# EAGLE design mcu (EAGLE 8.6.3)
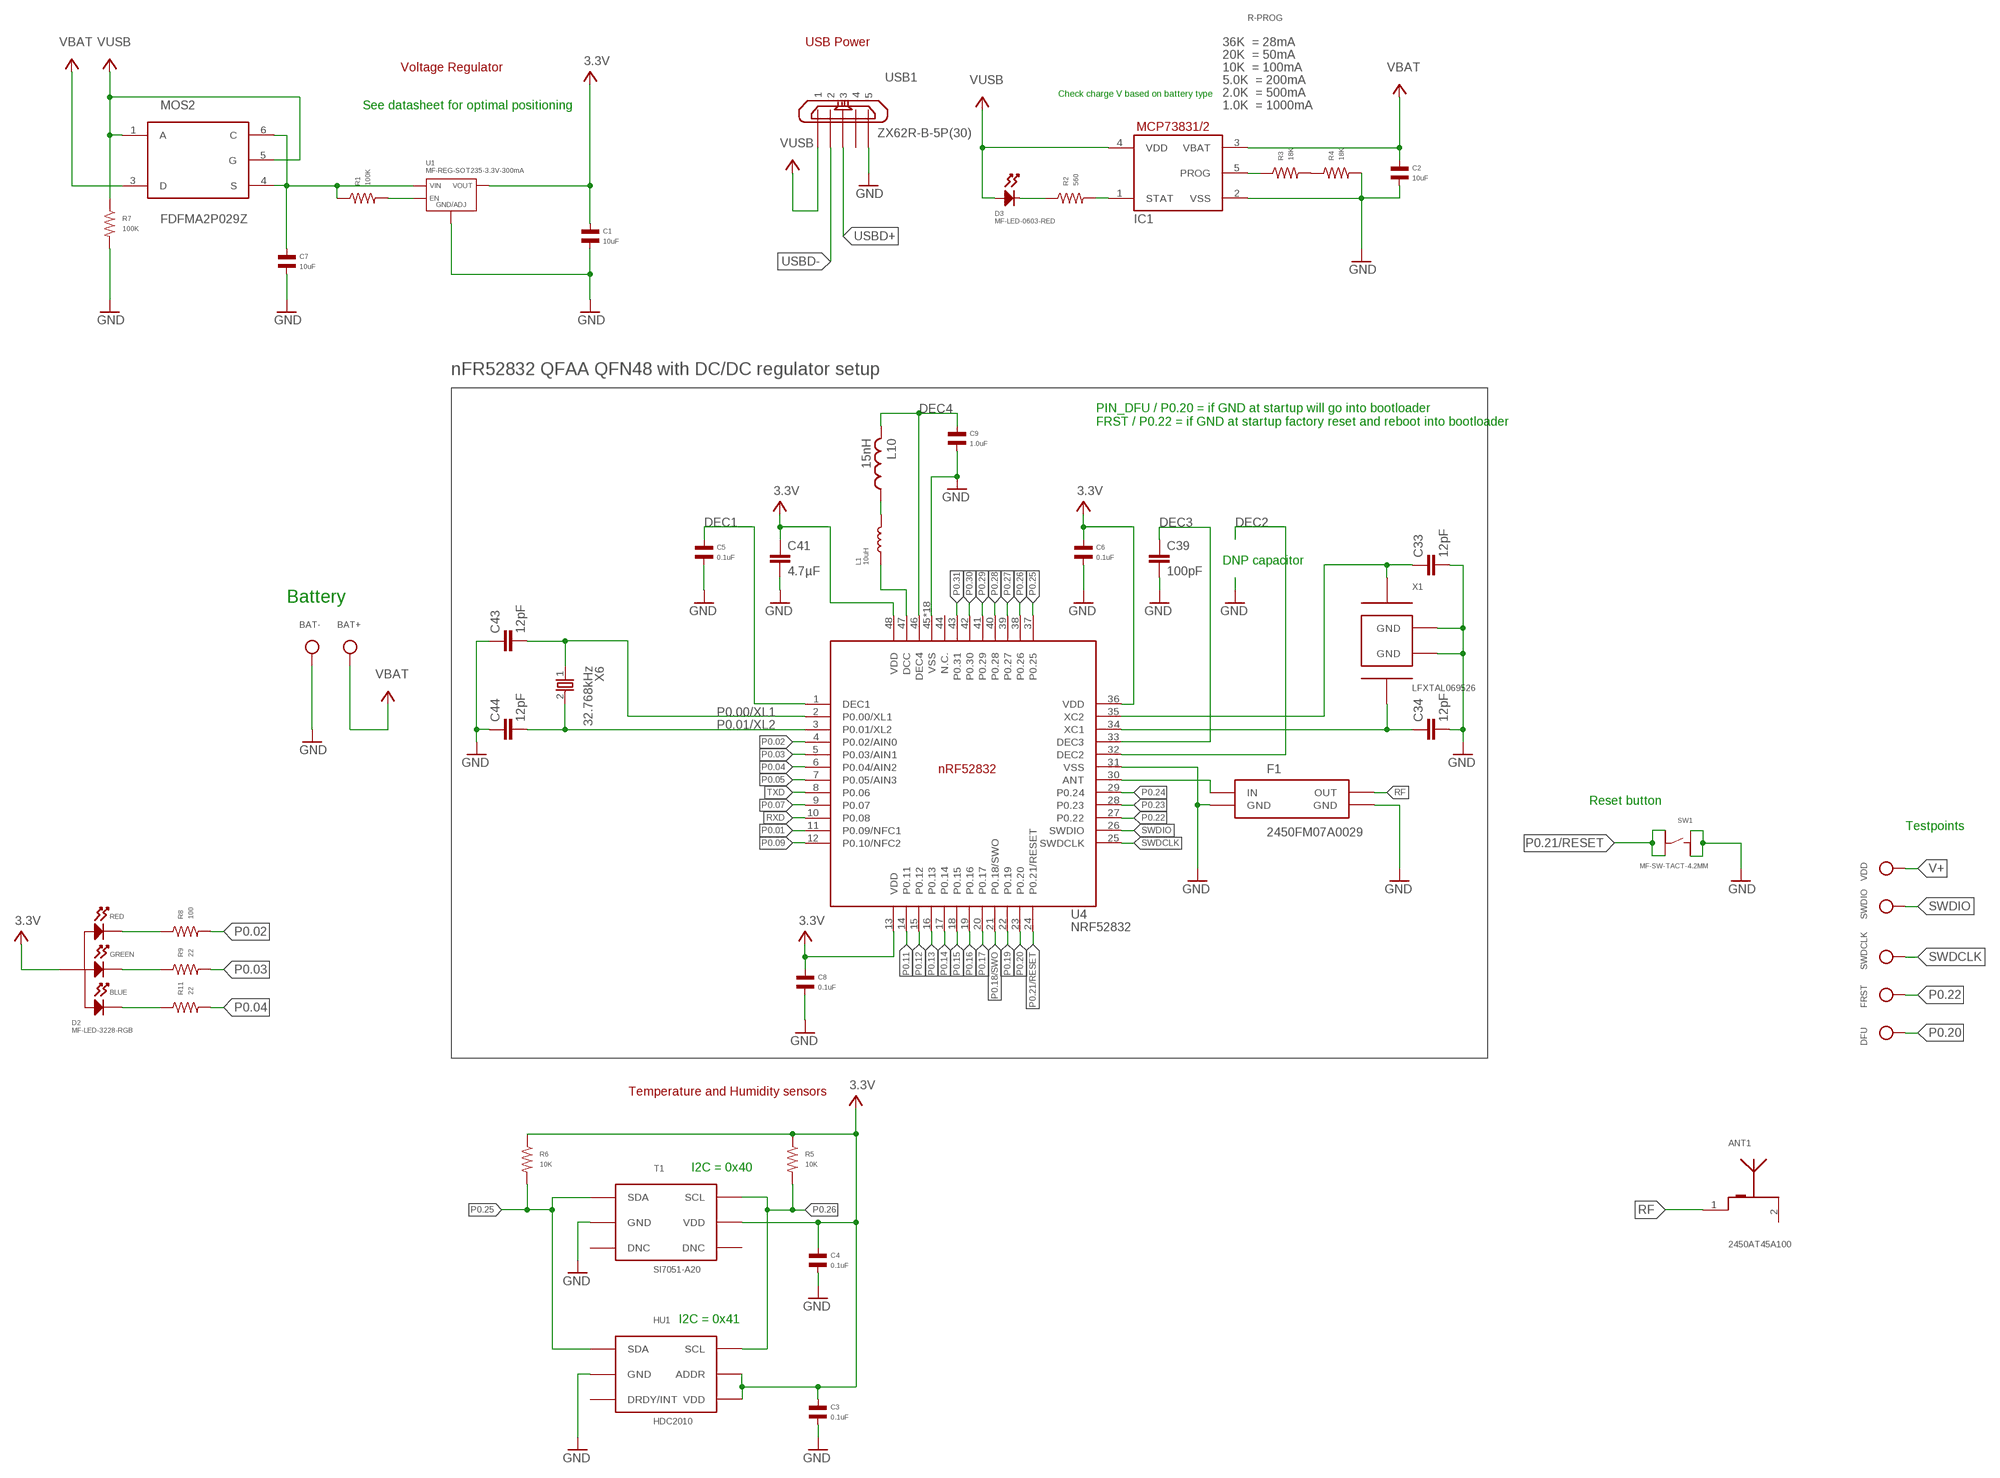
[diagram p0: schematic, sheet 1]

## Parts
ANT1  2450AT45A100  [2450AT45A100]
BAT+  TESTPOINTROUND2MM  [TESTPOINT_ROUND_2MM]
BAT-  TESTPOINTROUND2MM  [TESTPOINT_ROUND_2MM]
C1  10uF  CAPACITOR_NP_0603  [C0603]
C2  10uF  CAPACITOR_NP_0603  [C0603]
C3  0.1uF  CAPACITOR_NP_0402  [C0402]
C4  0.1uF  CAPACITOR_NP_0402  [C0402]
C5  0.1uF  CAPACITOR_NP_0402  [C0402]
C6  0.1uF  CAPACITOR_NP_0402  [C0402]
C7  10uF  CAPACITOR_NP_0603  [C0603]
C8  0.1uF  CAPACITOR_NP_0402  [C0402]
C9  1.0uF  CAPACITOR_NP_0603  [C0603]
C33  12pF  CAPACITOR_0402_N  [RESC0402_N]
C34  12pF  CAPACITOR_0402_N  [RESC0402_N]
C39  100pF  CAPACITOR_0402_N  [RESC0402_N]
C41  4.7µF  CAPACITOR_0603_N  [RESC0603_N]
C43  12pF  CAPACITOR_0402_N  [RESC0402_N]
C44  12pF  CAPACITOR_0402_N  [RESC0402_N]
D2  MF-LED-3228-RGB  LED_RGB_CA_PLCC4  [PLCC4]
D3  MF-LED-0603-RED  LED_SINGLE-0603-RED  [LED0603]
DFU  TESTPOINTROUND2MM  [TESTPOINT_ROUND_2MM]
F1  2450FM07A0029  [0402_RF]
FRST  TESTPOINTROUND2MM  [TESTPOINT_ROUND_2MM]
HU1  HDC2010  [DSBGA-6]
IC1  MCP73831/OT  [SOT23-5L]
L1  10uH  INDUCTOR_1210  [L1210]
L10  15nH  INDUCTOR_0402_N  [RESC0402_N]
MOS2  FDFMA2P029Z  [MICROFET_2X2]
R1  100K  RESISTOR_0402  [R0402]
R2  560  RESISTOR_0402  [R0402]
R3  18K  RESISTOR_0402  [R0402]
R4  18K  RESISTOR_0402  [R0402]
R5  10K  RESISTOR_0402  [R0402]
R6  10K  RESISTOR_0402  [R0402]
R7  100K  RESISTOR_0402  [R0402]
R8  100  RESISTOR_0402  [R0402]
R9  22  RESISTOR_0402  [R0402]
R11  22  RESISTOR_0402  [R0402]
SW1  MF-SW-TACT-4.2MM  TACT_4.2MM  [TACT4.2MM]
SWDCLK  TESTPOINTROUND2MM  [TESTPOINT_ROUND_2MM]
SWDIO  TESTPOINTROUND2MM  [TESTPOINT_ROUND_2MM]
T1  SI7051-A20  [DFN-6]
U1  MF-REG-SOT235-3.3V-300mA  TLV70233PDBVR  [SOT-23-5]
U4  NRF52832  [QFN40P600X600X90-48_N]
USB1  ZX62R-B-5P(30)  [ZX62R-B-5P(30)]
VDD  TESTPOINTROUND2MM  [TESTPOINT_ROUND_2MM]
X1  LFXTAL069526  [1612]
X6  32.768kHz  XTAL_32KHZ  [XTAL_3215_N]

## Nets
DEC1: C5.P$1 U4.1(DEC1)
DEC2: U4.32(DEC2)
DEC3: C39.1 U4.33(DEC3)
DEC4: C9.P$1 L10.2 U4.46(DEC4)
GND: BAT-.P$1 C1.P$2 C2.P$2 C3.P$2 C4.P$2 C5.P$2 C6.P$2 C7.P$2 C8.P$2 C9.P$2 C33.2 C34.2 C39.2 C41.2 C43.1 C44.1 F1.GND@2(GND) F1.GND@4(GND) HU1.C1(GND) IC1.2(VSS) R4.P$2 R7.P$2 SW1.P$1 SW1.P$2 T1.2(GND) U1.P$2(GND/ADJ) U4.31(VSS) U4.45(VSS) U4.PAD(VSS) U4.PAD@VIA01(VSS) U4.PAD@VIA02(VSS) U4.PAD@VIA03(VSS) U4.PAD@VIA04(VSS) U4.PAD@VIA05(VSS) U4.PAD@VIA06(VSS) U4.PAD@VIA07(VSS) U4.PAD@VIA08(VSS) U4.PAD@VIA09(VSS) U4.PAD@VIA10(VSS) U4.PAD@VIA11(VSS) U4.PAD@VIA12(VSS) U4.PAD@VIA13(VSS) U4.PAD@VIA14(VSS) U4.PAD@VIA15(VSS) U4.PAD@VIA16(VSS) USB1.5 X1.2(GND) X1.4(GND)
N$1: R1.P$2 U1.P$3(EN)
N$3: IC1.1(STAT) R2.P$2
N$4: D3.CATHODE R2.P$1
N$5: D2.P$2(CATHODE_RED) R8.P$1
N$6: IC1.5(PROG) R3.P$1
N$7: D2.P$3(CATHODE_GREEN) R9.P$1
N$8: C33.1 U4.35(XC2) X1.3
N$9: L1.P$2 L10.1
N$10: L1.P$1 U4.47(DCC)
N$12: C7.P$1 MOS2.4(S) MOS2.6(C) R1.P$1 U1.P$1(VIN)
N$13: R3.P$2 R4.P$1
N$14: D2.P$4(CATHODE_BLUE) R11.P$1
N$17: F1.1(IN) U4.30(ANT)
P0.00/XL1: C43.2 U4.2(P0.00/XL1) X6.1
P0.01: U4.11(P0.09/NFC1)
P0.01/XL2: C44.2 U4.3(P0.01/XL2) X6.2
P0.02: R8.P$2 U4.4(P0.02/AIN0)
P0.03: R9.P$2 U4.5(P0.03/AIN1)
P0.04: R11.P$2 U4.6(P0.04/AIN2)
P0.05: U4.7(P0.05/AIN3)
P0.07: U4.9(P0.07)
P0.09: U4.12(P0.10/NFC2)
P0.11: U4.14(P0.11)
P0.12: U4.15(P0.12)
P0.13: U4.16(P0.13)
P0.14: U4.17(P0.14)
P0.15: U4.18(P0.15)
P0.16: U4.19(P0.16)
P0.17: U4.20(P0.17)
P0.18/SWO: U4.21(P0.18/SWO)
P0.19: U4.22(P0.19)
P0.20: DFU.P$1 U4.23(P0.20)
P0.21/RESET: SW1.P$3 SW1.P$4 U4.24(P0.21/RESET)
P0.22: FRST.P$1 U4.27(P0.22)
P0.23: U4.28(P0.23)
P0.24: U4.29(P0.24)
P0.25: HU1.A2(SDA) R6.P$2 T1.1(SDA) U4.37(P0.25)
P0.26: HU1.B2(SCL) R5.P$2 T1.6(SCL) U4.38(P0.26)
P0.27: U4.39(P0.27)
P0.28: U4.40(P0.28)
P0.29: U4.41(P0.29)
P0.30: U4.42(P0.30)
P0.31: U4.43(P0.31)
RF: ANT1.1 F1.3(OUT)
RXD: U4.10(P0.08)
SWDCLK: SWDCLK.P$1 U4.25(SWDCLK)
SWDIO: SWDIO.P$1 U4.26(SWDIO)
TXD: U4.8(P0.06)
USBD+: USB1.3
USBD-: USB1.2
V+: C1.P$1 C3.P$1 C4.P$1 C6.P$1 C8.P$1 C41.1 D2.P$1(ANODE) HU1.A1(VDD) HU1.B1(ADDR) R5.P$1 R6.P$1 T1.5(VDD) U1.P$5(VOUT) U4.13(VDD) U4.36(VDD) U4.48(VDD) VDD.P$1 ; supply symbol labelled 3.3V
VBAT: BAT+.P$1 C2.P$1 IC1.3(VBAT) MOS2.3(D)
VUSB: D3.ANODE IC1.4(VDD) MOS2.1(A) MOS2.5(G) R7.P$1 USB1.1
X3: C34.1 U4.34(XC1) X1.1
Unconnected: ANT1.2 HU1.C2(DRDY/INT) T1.3(DNC) T1.4(DNC) U4.44(N.C.) USB1.4

## Notes on the sheet
- R-PROG
- USB Power | 36K  = 28mA
- 20K  = 50mA
- Voltage Regulator | 10K  = 100mA
- 5.0K  = 200mA
- Check charge V based on battery type | 2.0K  = 500mA
- See datasheet for optimal positioning | 1.0K  = 1000mA
- nFR52832 QFAA QFN48 with DC/DC regulator setup
- PIN_DFU / P0.20 = if GND at startup will go into bootloader
  FRST / P0.22 = if GND at startup factory reset and reboot into bootloader
- DNP capacitor
- Battery
- Reset button
- Testpoints
- Temperature and Humidity sensors
- I2C = 0x40
- I2C = 0x41

## Library data of the parts
ANT1 = tilesPartComp:2450AT45A100: 2450AT45A100 Antenna; MPN: 2450AT45A100E
BAT+ BAT- DFU FRST SWDCLK SWDIO VDD = microbuilder:TESTPOINT: Test Point Various test points for characterisation and PCB testing TESTPOINT_SMT - Compact Surface Mount Test Point [Digikey: 5016KTR-ND]
C1 C2 C7 = MF_Passives:CAPACITOR_NP: Library: MF_Passives Description: Device for Non-Polarized Capacitors. Manufacture part number (MPN) can be added via Attributes. Check https://factory.macrofab.com/parts for the house parts list.; HOUSEPART: YES; MPN: JMK107ABJ106KA-T; POPULATE: 1
C3-C6 C8 = MF_Passives:CAPACITOR_NP: Library: MF_Passives Description: Device for Non-Polarized Capacitors. Manufacture part number (MPN) can be added via Attributes. Check https://factory.macrofab.com/parts for the house parts list.; HOUSEPART: YES; MPN: MF-CAP-0402-0.1uF; POPULATE: 1
C9 = MF_Passives:CAPACITOR_NP: Library: MF_Passives Description: Device for Non-Polarized Capacitors. Manufacture part number (MPN) can be added via Attributes. Check https://factory.macrofab.com/parts for the house parts list.; HOUSEPART: YES; MPN: MF-CAP-0603-1uF; POPULATE: 1
C33 C34 C43 C44 = Nordic_nRF:CAPACITOR: Generic chip capacitor; MPN: C0402C120J5GACTU
C39 = Nordic_nRF:CAPACITOR: Generic chip capacitor; MPN: GRM1555C1H101GA01D
C41 = Nordic_nRF:CAPACITOR: Generic chip capacitor; MPN: 06036D475KAT2A
D2 = MF_LEDs:LED_RGB_CA: Library: MF_LEDs Description: Device for RGB LED Packages with Common Anodes. Manufacture part number (MFG#) can be added via Attributes.; HOUSEPART: YES; MPN: MF-LED-3228-RGB; POPULATE: 1; URL: https://factory.macrofab.com/part/MF-LED-3228-RGB
D3 = MF_LEDs:LED_SINGLE: Library: MF_LEDs Description: Device for Single LED Packages. Manufacture part number (MFG#) can be added via Attributes.; HOUSEPART: YES; MPN: MF-LED-0603-RED; POPULATE: 1; URL: https://factory.macrofab.com/part/MF-LED-0603-RED
F1 = tilesPartComp:2450FM07A0029: 2450FM07A0029 Impedance matcher filter From Johanson Technology, for nRF52832 QFA; MPN: 2450FM07A0029T
HU1 = tilesPartComp:HDC2010; MPN: HDC2010YPAR
IC1 = adafruit:MCP73831: MCP73831/2 Miniature Single-Cell, Fully Integrated Li-Ion, Li-Polymer Charge Management Controllers. Nice and small simple lipoly charge controller, with adjustable current and status output (LED) http://www.ladyada.net/library/pcb/eaglelibrary.html; MPN: MCP73831T-2ACI/OT
L1 = MF_Passives:INDUCTOR: Library: MF_Passives Description: Device for Inductors. Manufacture part number (MPN) can be added via Attributes. Check https://factory.macrofab.com/parts for the house parts list.; HOUSEPART: YES; MPN: MF-IND-1210-10uH
L10 = Nordic_nRF:INDUCTOR: Generic chip inductor; MPN: L-07C15NJV6T
MOS2 = tilesPartComp:FDFMA2P029Z; MPN: FDFMA2P029Z
R1 R7 = MF_Passives:RESISTOR: Library: MF_Passives Description: Device for Resistors. Manufacture part number (MPN), Voltage, Tolerance, and Wattage Rating can be added via Attributes. Check https://factory.macrofab.com/parts for the house parts list.; HOUSEPART: YES; MPN: MF-RES-0402-100K; POPULATE: 1
R2 = MF_Passives:RESISTOR: Library: MF_Passives Description: Device for Resistors. Manufacture part number (MPN), Voltage, Tolerance, and Wattage Rating can be added via Attributes. Check https://factory.macrofab.com/parts for the house parts list.; HOUSEPART: YES; MPN: MF-RES-0402-560; POPULATE: 1
R3 R4 = MF_Passives:RESISTOR: Library: MF_Passives Description: Device for Resistors. Manufacture part number (MPN), Voltage, Tolerance, and Wattage Rating can be added via Attributes. Check https://factory.macrofab.com/parts for the house parts list.; HOUSEPART: YES; MPN: MF-RES-0402-18K; POPULATE: 1
R5 R6 = MF_Passives:RESISTOR: Library: MF_Passives Description: Device for Resistors. Manufacture part number (MPN), Voltage, Tolerance, and Wattage Rating can be added via Attributes. Check https://factory.macrofab.com/parts for the house parts list.; HOUSEPART: YES; MPN: MF-RES-0402-10K; POPULATE: 1
R8 = MF_Passives:RESISTOR: Library: MF_Passives Description: Device for Resistors. Manufacture part number (MPN), Voltage, Tolerance, and Wattage Rating can be added via Attributes. Check https://factory.macrofab.com/parts for the house parts list.; HOUSEPART: YES; MPN: MF-RES-0402-100; POPULATE: 1
R9 R11 = MF_Passives:RESISTOR: Library: MF_Passives Description: Device for Resistors. Manufacture part number (MPN), Voltage, Tolerance, and Wattage Rating can be added via Attributes. Check https://factory.macrofab.com/parts for the house parts list.; HOUSEPART: YES; MPN: MF-RES-0402-22; POPULATE: 1
SW1 = MF_Switches:TACT: Library: MF_Switches Description: Device for Tact Switches. Manufacture part number (MFG#) can be added via Attributes.; HOUSEPART: YES; MPN: MF-SW-TACT-4.2MM; POPULATE: 1; URL: https://factory.macrofab.com/part/MF-SW-TACT-4.2MM
T1 = tilesPartComp:SI7051-A20; MPN: SI7051-A20-IM
U1 = MF_IC_Power:TLV702: Manufacturer Part #: TLV702 Manufacturer: Texas Instruments Description: LDO Voltage Regulators; HOUSEPART: YES; MPN: MF-REG-SOT235-3.3V-300mA; POPULATE: 1; URL: https://factory.macrofab.com/part/MF-REG-SOT235-3.3V-300mA
U4 = Nordic_nRF:NRF52832: nRF52832 Features Single chip, highly flexible, 2.4 GHz multi-protocol SoC 32-bit ARM Cortex-M4F Processor 1.7v to 3.6v operation 512kB flash + 64kB RAM Supports concurrent Bluetooth Smart/ANT protocol operation On-chip NFC tag for Out-of-Band (OOB) pairing Up to +4dBm output power -96dBm sensitivity, Bluetooth Smart Thread safe and run-time protected Event driven API On air compatible with nRF24L and nRF24AP series 2 data rates (2Mbps/1Mbps) PPI - maximum flexibility for power-efficient applications and code simplification Automated power management system with automatic power management of each peripheral Configurable I/O mapping for analog and digital I/O 3 x Master/Slave SPI 2 x Two-wire interface (I²C) UART (RTS/CTS) 3 x PWM AES HW encryption Real Time Counter (RTC) Digital microphone interface (PDM) On-chip balun Applications Internet of Things (IoT) Wearables SmartHome sensors Connected white goods Computer peripherals Voice-command smart remotes A4WP ‘Rezence’ wireless charging Beacons Sports and fitness sensors and hubs Connected health products Smart watches RC Toys Interactive games Building automation and sensor networks; MPN: NRF52832-QFAA-R7
USB1 = tilesPartComp:ZX62R-B-5P(30); MPN: ZX62R-B-5P(30)
X1 = tilesPartComp:LFXTAL069526: LFXTAL069526 32MHz Crystal 1612 package; MPN: LFXTAL069526CUTT
X6 = Nordic_nRF:XTAL_32KHZ; MPN: LFXTAL009706REEL

## Board
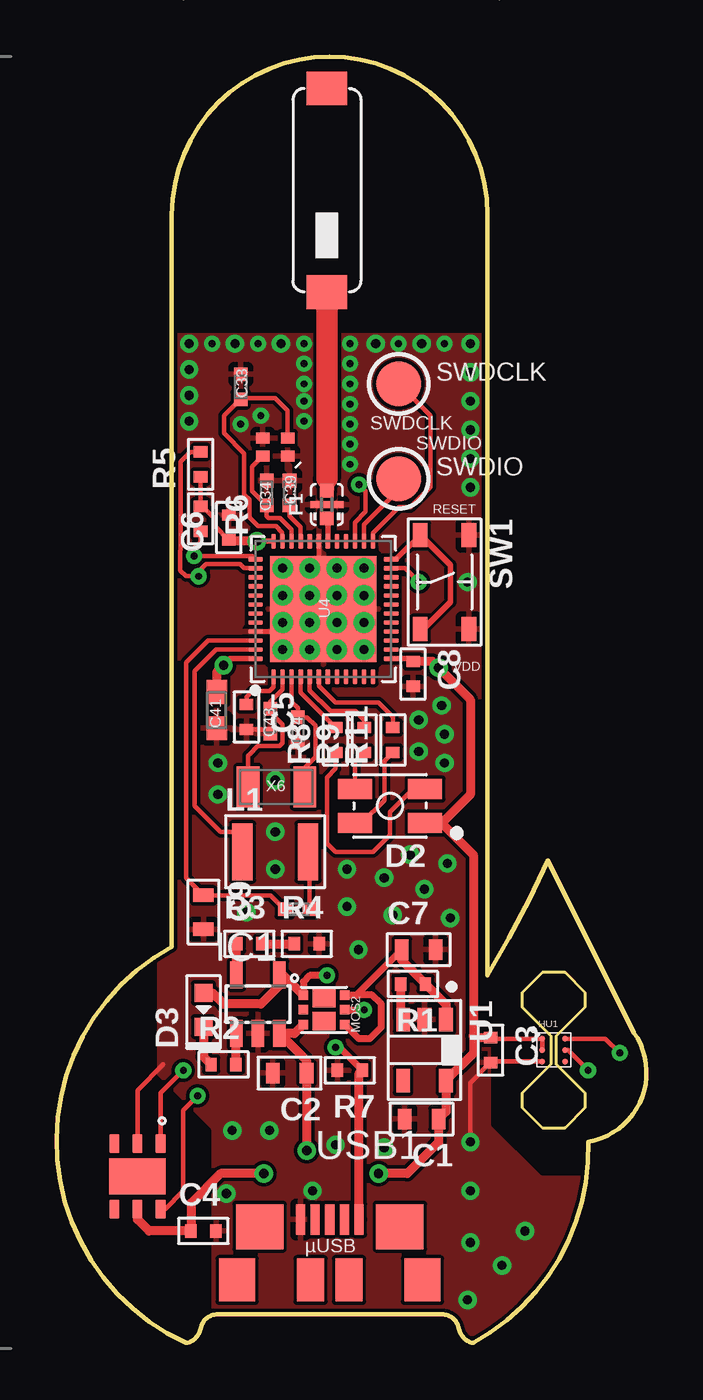
[diagram p1: board, top side]
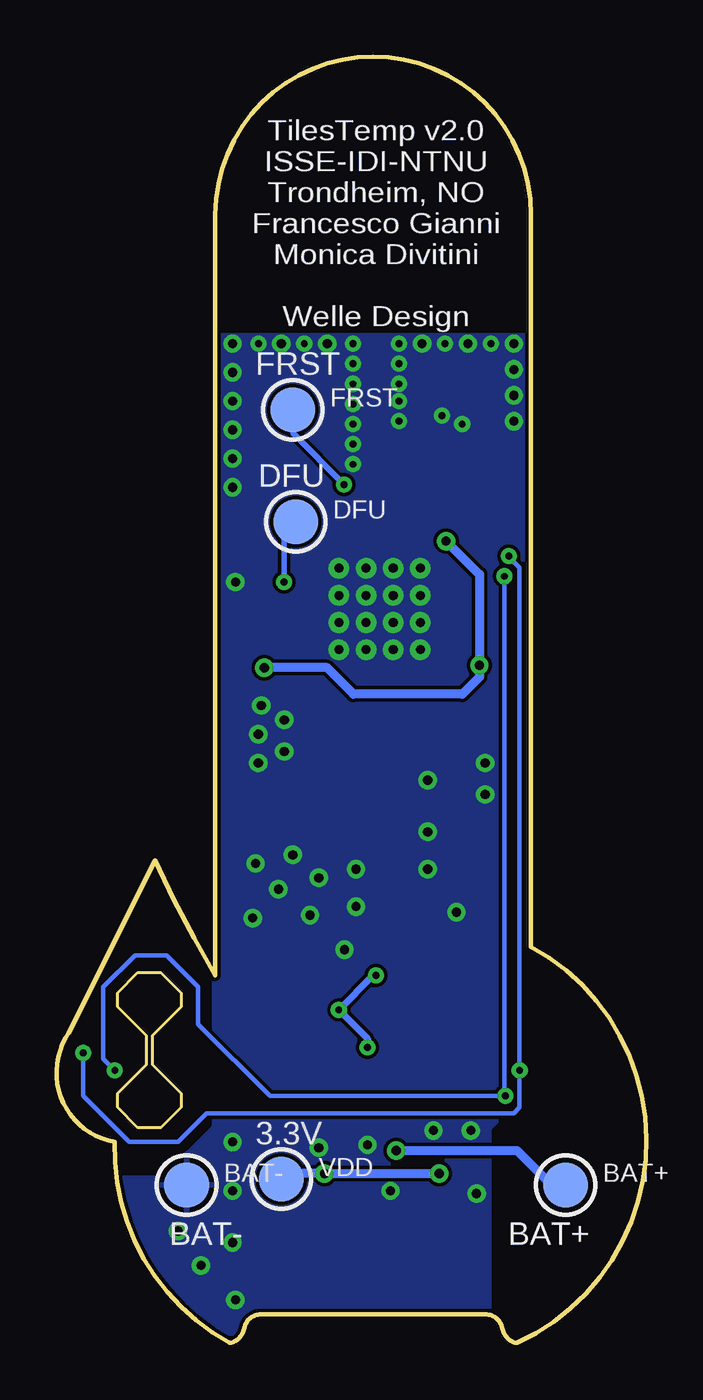
[diagram p2: board, bottom side, seen from below]

Size 26.1 x 56.9 mm. Coordinates in mm from the lower left corner, seen from the top.
Outline: 5.1,17.53 5.1,49.91 arc-180 19.07,49.91 19.07,16.26 arc6 21.74,21.34 25.55,13.72 arc-115 23.52,8.89 arc-63 18.44,0 arc-69 17.8,0.63 arc80 17.04,1.27 7.14,1.27 arc80 6.37,0.63 arc-69 5.74,0 arc-127 5.1,17.53
Outline: 22.12,13.59 23.39,14.86 23.39,15.49 22.5,16.38 21.49,16.38 20.6,15.49 20.6,14.86 21.87,13.59 21.87,12.32 20.6,11.05 20.6,10.41 21.49,9.52 22.5,9.52 23.39,10.41 23.39,11.05 22.12,12.32 22.12,13.59
Copper layers (1*16): Top 0.035mm / dielectric 1.5mm / Bottom 0.035mm
Design rules "default *": minimum track width 6mil, minimum drill 12mil, track to track 6mil, track to pad 6mil, pad to pad 6mil, via to via 6mil, smd to smd 6mil, copper to edge 6mil, drill to drill 6mil, minimum pad ring 10mil, minimum via ring 8mil, stop-mask expansion 4mil, vias tented up to drill 0mil, thermal gap 10mil

### Footprints (pad centres in the part's own frame; a part is rotated, then mirrored left to right if it is on the bottom)
2450AT45A100 = smd 1.8 x 1.5: 1 0,0; 2 0,9
TESTPOINT_ROUND_2MM = smd 2 x 2: P$1 0,0
C0603 = smd 0.6 x 0.9: P$1 -0.75,0; P$2 0.75,0
C0402 = smd 0.5 x 0.6: P$1 -0.55,0; P$2 0.55,0
RESC0402_N = smd 0.6 x 0.6: 1 -0.55,0; 2 0.55,0
RESC0603_N = smd 1.05 x 0.9: 1 -0.8,0; 2 0.8,0
PLCC4 = smd 1.5 x 0.9: P$1 -1.55,0.75; P$2 -1.55,-0.75; P$3 1.55,-0.75; P$4 1.55,0.75
LED0603 = smd 0.8 x 0.8: ANODE 0.75,0; CATHODE -0.75,0
0402_RF = smd 0.6 x 0.6: 1 -0.613,0; 3 0.613,0 | smd 0.3 x 0.725: GND@2 0,-0.362; GND@4 0,0.362
DSBGA-6 = smd 0.263 x 0.263: A1 -0.5,0.5; A2 0.5,0.5; B1 -0.5,0; B2 0.5,0; C1 -0.5,-0.5; C2 0.5,-0.5
SOT23-5L = smd 0.55 x 1.2: 1 -0.95,-1.3; 2 0,-1.3; 3 0.95,-1.3; 4 0.95,1.3; 5 -0.95,1.3
L1210 = smd 0.9 x 2.5: P$1 -1.45,0; P$2 1.45,0
MICROFET_2X2 = smd 0.42 x 0.42: 1 0.65,0.915; 2 0,0.915; 3 -0.65,0.915; 4 -0.65,-0.915; 5 0,-0.915; 6 0.65,-0.915 | smd 0.8 x 1: C 0.5,0; D -0.5,0
R0402 = smd 0.5 x 0.6: P$1 -0.55,0; P$2 0.55,0
TACT4.2MM = smd 1.05 x 0.65: P$1 -2.075,1.075; P$2 2.075,1.075; P$3 -2.075,-1.075; P$4 2.075,-1.075
DFN-6 = smd 0.85 x 0.45: 1 -1.45,1.025; 2 -1.45,0; 3 -1.45,-1.025; 4 1.45,-1.025; 5 1.45,0; 6 1.45,1.025 | smd 1.6 x 2.5: DNC 0,0
SOT-23-5 = smd 1.05 x 0.6: P$1 -1.35,0.95; P$2 -1.35,0; P$3 -1.35,-0.95; P$4 1.35,-0.95; P$5 1.35,0.95
QFN40P600X600X90-48_N = smd 0.65 x 0.2: 1 -3,2.2; 2 -3,1.8; 3 -3,1.4; 4 -3,1; 5 -3,0.6; 6 -3,0.2; 7 -3,-0.2; 8 -3,-0.6; 9 -3,-1; 10 -3,-1.4; 11 -3,-1.8; 12 -3,-2.2; 25 3,-2.2; 26 3,-1.8; 27 3,-1.4; 28 3,-1; 29 3,-0.6; 30 3,-0.2; 31 3,0.2; 32 3,0.6; 33 3,1; 34 3,1.4; 35 3,1.8; 36 3,2.2 | smd 0.2 x 0.65: 13 -2.2,-3; 14 -1.8,-3; 15 -1.4,-3; 16 -1,-3; 17 -0.6,-3; 18 -0.2,-3; 19 0.2,-3; 20 0.6,-3; 21 1,-3; 22 1.4,-3; 23 1.8,-3; 24 2.2,-3; 37 2.2,3; 38 1.8,3; 39 1.4,3; 40 1,3; 41 0.6,3; 42 0.2,3; 43 -0.2,3; 44 -0.6,3; 45 -1,3; 46 -1.4,3; 47 -1.8,3; 48 -2.2,3 | smd 4.7 x 4.7: PAD 0,0 | drill 0.4: PAD@VIA01 -1.8,1.8; PAD@VIA02 -1.8,0.6; PAD@VIA03 -1.8,-0.6; PAD@VIA04 -1.8,-1.8; PAD@VIA05 -0.6,1.8; PAD@VIA06 -0.6,0.6; PAD@VIA07 -0.6,-0.6; PAD@VIA08 -0.6,-1.8; PAD@VIA09 0.6,1.8; PAD@VIA10 0.6,0.6; PAD@VIA11 0.6,-0.6; PAD@VIA12 0.6,-1.8; PAD@VIA13 1.8,1.8; PAD@VIA14 1.8,0.6; PAD@VIA15 1.8,-0.6; PAD@VIA16 1.8,-1.8
ZX62R-B-5P(30) = smd 0.4 x 1.35: 1 1.3,4.325; 2 0.65,4.325; 3 0,4.325; 4 -0.65,4.325; 5 -1.3,4.325 | smd 1.6 x 1.9: M1 4.1,1.65; M2 -4.1,1.65 | smd 2.1 x 2: M3 -3.1,4; M4 3.1,4 | smd 1.2 x 1.9: M5 -0.85,1.65; M6 0.85,1.65
1612 = smd 0.6 x 0.5: 1 0.55,0.4; 2 -0.55,0.4; 3 -0.55,-0.4; 4 0.55,-0.4
XTAL_3215_N = smd 1 x 1.8: 1 -1.25,0; 2 1.25,0

### Placement (x,y rotation side)
ANT1  11.96,46.48 0 top
BAT+  3.58,6.98 0 bottom
BAT-  20.34,6.98 0 bottom
C1  16.15,9.91 180 top
C2  10.31,11.94 180 top
C3  19.2,12.95 270 top
C4  6.5,4.95 0 top
C5  8.41,27.69 270 top
C6  7.62,36.07 90 top
C7  16.03,17.4 0 top
C8  15.77,29.59 270 top
C9  6.5,19.05 270 top
C33  8.15,42.29 90 top
C34  9.3,37.59 90 top
C39  10.31,37.59 90 top
C41  7.09,27.99 270 top
C43  9.45,27.5 90 top
C44  10.68,27.12 90 top
D2  14.76,23.75 180 top
D3  6.5,14.73 90 top
DFU  15.52,36.32 0 bottom
F1  11.96,37.08 90 top
FRST  15.65,41.27 0 bottom
HU1  22,12.95 0 top
IC1  8.91,14.99 0 top
L1  9.68,21.72 0 top
L10  10.64,19.19 180 top
MOS2  11.84,14.73 90 top
R1  15.77,15.88 180 top
R2  7.39,12.32 0 top
R3  8.53,17.65 0 top
R4  11.07,17.65 0 top
R5  6.37,38.86 90 top
R6  6.37,36.45 270 top
R7  12.98,12.06 180 top
R8  12.34,26.67 90 top
R9  13.61,26.67 90 top
R11  14.88,26.67 90 top
SW1  17.17,33.66 270 top
SWDCLK  15.14,42.42 0 top
SWDIO  15.14,38.23 0 top
T1  3.58,7.37 270 top
U1  16.28,12.95 270 top
U4  11.8,32.46 90 top
USB1  12.09,1.14 0 top
VDD  16.15,7.24 0 bottom
X1  9.68,39.62 180 top
X6  9.73,24.59 0 top

### Tracks (layer width: path | path; a pad name or v marks a point on that pad's centre or on a via)
DEC1
  Top 0.203: U4.1 9.6,29.01 9.43,28.83 8.66,28.83 8.41,28.57 C5.P$1
DEC3
  Top 0.203: C39.1 10.31,36.57 10.8,36.08 U4.33
DEC4
  Top 0.203: U4.46 6.7,31.06 5.74,30.1 5.74,20.56 C9.P$1 9.48,19.8 L10.2 9.97,19.3
GND  (via drill 0.3, 0.41)
  Top 0.2: U4.PAD@VIA14 arc90 11.61,34.31 12.01,34.31 arc-90 U4.PAD@VIA15 | 9.81,31.51 arc90 U4.PAD@VIA05 | U4.PAD@VIA01 10,31.46 | 10,31.46 U4.PAD@VIA05 | U4.PAD@VIA05 U4.PAD@VIA09 U4.PAD@VIA13 U4.PAD@VIA14 | U4.PAD@VIA02 U4.PAD@VIA06 | U4.PAD@VIA06 U4.PAD@VIA10 U4.PAD@VIA14 | U4.PAD@VIA15 U4.PAD@VIA16 U4.PAD@VIA12 | U4.PAD@VIA15 U4.PAD@VIA11 U4.PAD@VIA07 U4.PAD@VIA03 U4.PAD@VIA04 U4.PAD@VIA08 | U4.PAD@VIA06 arc90 U4.PAD | U4.45 10,31.46
  Top 0.203: U4.31 11.6,34.32 11.61,34.31 | T1.2 3.58,11.18 4.72,12.32 | HU1.C1 19.2,12.45 C3.P$2 18.31,11.52 v18.31,8.89 | C43.1 9.26,27.14 C5.P$2
  Top 0.406: 7.35,26.93 C41.2 | 9.44,26.93 C43.1
  other vias: 15.65,21.59 14.12,44.2 16.15,44.2 17.17,26.92 17.3,21.21 17.17,25.65 9.93,44.2 7.9,44.2 5.87,44.2 9.42,9.4 7.77,9.4 14.5,8.64 18.31,4.45 18.31,6.73 12.85,20.95 6.88,44.2 8.91,44.2 10.95,44.2 12.98,44.2 15.14,44.2 17.17,44.2 5.87,43.05 18.19,33.66 16.03,26.16 8.15,40.64 9.04,41.02 10.95,40.77 16.03,27.56 17.04,28.19 18.31,44.2 10.95,43.31 10.95,42.42 10.95,41.66 12.98,43.31 12.98,42.42 12.98,41.53 12.98,40.64 12.98,39.75 12.98,38.86 18.31,42.93 18.31,41.66 18.31,40.39 18.31,39.12 18.31,37.85 5.87,41.91 5.87,40.77 20.73,4.95 19.71,3.43 18.19,1.9 12.34,8.76 11.33,6.73 7.52,6.6 9.68,24.89 9.68,20.95 7.14,25.65 8.41,19.05 7.14,24.26 13.36,17.4 12.85,19.3 17.42,18.8 14.88,18.92 14.5,20.57 16.28,20.07 9.68,22.61
  pour Top (rank 2): -22.33,44.58 50.06,44.58 50.06,-20.57 -22.33,-20.57
  pour Bottom (rank 2): -21.06,44.58 48.79,44.58 48.79,-19.3 -21.06,-19.3
N$1
  Top 0.406: R1.P$2 15.22,14.41 U1.P$3
N$3
  Top 0.406: R2.P$2 7.94,13.66 IC1.1
N$4
  Top 0.406: D3.CATHODE 6.5,12.66 R2.P$1
N$5
  Top 0.203: R8.P$1 12.34,25.4 11.96,25.02 11.96,22.1 12.34,21.72 13.99,21.72 14.76,22.48 14.76,23.49 15.76,24.5 D2.P$2
N$6
  Top 0.406: 7.9,16.35 IC1.5 7.96,17.63 R3.P$1
N$7
  Top 0.203: R9.P$1 13.21,25.71 D2.P$3
N$8
  Top 0.203: X1.3 10.23,41.23 9.68,41.78 8.19,41.78 C33.1 7.42,41 7.42,40.23 8.3,39.34 8.3,37.53 8.53,37.3 8.53,36.5 8.91,36.12 9.71,36.12 9.99,35.85 9.99,35.48 U4.35
N$9
  Top 0.203: L10.1 11.19,21.65 L1.P$2
N$10
  Top 0.203: U4.47 7.07,30.66 6.12,29.72 6.12,23.88 6.12,23.82 6.12,23.75 7.26,22.61 7.9,22.61 8.23,22.28 L1.P$1
N$11
  cutout Bottom (isolate 0.61): 19.33,21.84 19.33,9.65 21.49,7.49 28.47,7.49 28.47,22.35 19.33,22.35
N$12
  Top 0.305: MOS2.4 13.37,13.46 13.87,13.46 14.38,13.97 14.38,14.99 13.97,15.39 13.34,15.39 13.33,15.38 MOS2.6 13.26,15.38 C7.P$1
  Top 0.406: U1.P$1 17.23,14.97 R1.P$1 15.28,16.92 C7.P$1
N$13
  Top 0.406: R3.P$2 R4.P$1
N$14
  Top 0.203: R11.P$1 14.5,25.74 14.5,24 13.5,23 D2.P$4
N$15
  cutout Top (isolate 0.61): 4.34,18.8 4.34,11.81 6.76,9.4 6.76,-0.64 -1.63,-0.64 -1.63,18.8
  cutout Bottom (isolate 0.61): 4.34,18.8 4.34,11.81 6.76,9.4 6.76,-0.64 -1.63,-0.64 -1.63,18.8
N$16
  cutout Top (isolate 0.61): 19.33,19.94 19.33,9.65 21.49,7.49 28.47,7.49 28.47,23.24 19.33,23.24
N$17
  Top 0.203: 12,36.43 F1.1
  Top 0.254: U4.30 12,36.43
P0.00/XL1
  Top 0.203: U4.2 10,28.9 9.45,28.35 C43.2 9.45,27.91 10.01,27.35 10.01,26.54 9.86,26.39 8.89,26.39 8.53,26.03 8.48,25.98 X6.1
P0.01/XL2
  Top 0.203: U4.3 10.4,28.35 10.68,28.08 C44.2 11.09,27.67 11.45,27.3 11.45,26.42 11.45,25.91 10.98,25.43 X6.2
P0.02
  Top 0.203: U4.4 10.8,28.76 R8.P$2
P0.03
  Top 0.203: U4.5 11.2,28.86 12.13,27.94 13.23,27.94 13.61,27.56 R9.P$2
P0.04
  Top 0.203: U4.6 11.6,29.06 12.34,28.32 14.25,28.32 14.88,27.69 R11.P$2
P0.20  (via drill 0.3)
  Top 0.203: U4.23 15.42,34.26 v16.03,33.66
  Bottom 0.254: v16.03,33.66 16.03,35.81 DFU.P$1
P0.21/RESET
  Top 0.254: U4.24 15.03,34.66 SW1.P$3 17.42,34.4 17.42,32.77 16.24,31.58 SW1.P$4
P0.22  (via drill 0.3)
  Top 0.203: U4.27 13.2,36.29 13.68,36.76 13.68,37.68 v13.38,37.97
  Bottom 0.254: v13.38,37.97 15.65,40.23 FRST.P$1
P0.25  (via drill 0.3)
  Top 0.203: U4.37 8.66,34.8 6.45,34.8 v6.09,34.8 6.09,35.15 6.37,35.43 R6.P$2 | 22.5,13.46 HU1.A2 24.29,13.45 v24.92,12.83 | v5.61,12.06 4.61,11.06 T1.1
  Bottom 0.203: v6.09,34.8 6.09,34.77 5.61,34.29 v5.61,12.06 5.61,10.41 5.87,10.16 19.46,10.16 20.73,8.89 22.88,8.89 24.92,10.92 v24.92,12.83
P0.26  (via drill 0.3)
  Top 0.203: U4.38 8.31,34.26 8.12,34.45 6.63,34.45 6.29,34.11 v6.29,33.91 5.74,33.91 5.48,34.17 5.48,35.05 5.49,35.06 5.49,38.99 5.91,39.41 R5.P$2 | v6.25,10.92 5.61,10.29 5.61,6.73 4.8,5.92 T1.6 | v23.52,12.06 22.63,12.95 HU1.B2
  Bottom 0.203: v6.29,33.91 6.29,10.97 v6.25,10.92 16.66,10.92 19.84,14.1 19.84,15.75 21.23,17.14 22.63,17.14 24.03,15.75 24.03,12.57 v23.52,12.06
P0.31
  Top 0.203: U4.43
RF
  Top 0.61: 11.96,38.23 F1.3
  Top 0.94: ANT1.1 11.96,38.23
SWDCLK
  Top 0.2: U4.25 14,35.66
  Top 0.203: U4.25 14,35.82 15.15,36.97 15.66,36.97 16.53,37.85 16.53,41.02 SWDCLK.P$1
SWDIO
  Top 0.203: U4.26 13.6,36.19 15.14,37.72 SWDIO.P$1
V+  (via drill 0.41, 0.41 pad 0.8)
  Top 0.203: HU1.B1 HU1.A1 19.2,13.45 C3.P$1 | C6.P$1 7.01,36.13 7.01,36.45 6.46,37 R6.P$1 R5.P$1
  Top 0.254: U4.48 7.68,30.26 v7.39,29.97 | U4.36 v8.87,35.46 | U4.13 15.65,30.26 C8.P$1
  Top 0.406: v7.39,29.97 7.09,29.67 C41.1 | 18.44,13.59 18.44,21.59 17.03,23 D2.P$1 17.05,23 18.31,24.26 18.31,28.45 v16.9,29.86 16.63,30.14 C8.P$1 | 18.44,13.59 18.44,12.81 U1.P$5 17.23,10.23 C1.P$1 16.9,8.88 15.52,7.49 v14.25,7.49 | C3.P$1 18.52,13.5 18.44,13.59 | v9.17,7.49 7.26,7.49 5.95,6.18 C4.P$1 4.09,4.95 3.58,5.46 T1.5 | v8.87,35.46 7.67,35.46 C6.P$1
  Bottom 0.406: v8.87,35.46 7.39,33.99 v7.39,29.97 7.39,29.46 8.15,28.7 12.97,28.7 14.13,29.86 v16.9,29.86 | v9.17,7.49 v14.25,7.49 15.9,7.49 VDD.P$1
VBAT  (via drill 0.41)
  Top 0.406: v11.07,8.51 11.07,11.93 C2.P$1 11.06,12.49 IC1.3 10.52,13.69 MOS2.3
  Bottom 0.406: v11.07,8.51 5.74,8.51 4.22,6.98 BAT+.P$1
VUSB  (via drill 0.3)
  Top 0.305: v12.34,13.08 12.51,13.08 R7.P$1 | MOS2.5 v13.61,14.73 | v11.96,16.26 11.2,16.26 10.92,15.98 MOS2.1
  Top 0.406: D3.ANODE 6.89,15.48 7.39,14.99 9.04,14.99 9.86,15.81 IC1.4 10.02,16.29 MOS2.1 | USB1.1 13.39,11.93 R7.P$1
  Bottom 0.305: v12.34,13.08 12.34,13.46 v13.61,14.73 12.09,16.26 v11.96,16.26
X3
  Top 0.203: U4.34 10.4,35.98 10.18,36.2 9.9,36.48 9.39,36.48 9.3,36.58 C34.1 8.66,37.68 8.66,38.76 X1.1

### Text on the board
tPlace: SWDCLK | SWDIO | RESET | VDD
bPlace: TilesTemp v2.0 / ISSE-IDI-NTNU / Trondheim, NO / Francesco Gianni / Monica Divitini / / Welle Design | FRST | DFU | 3.3V | BAT+ | BAT-